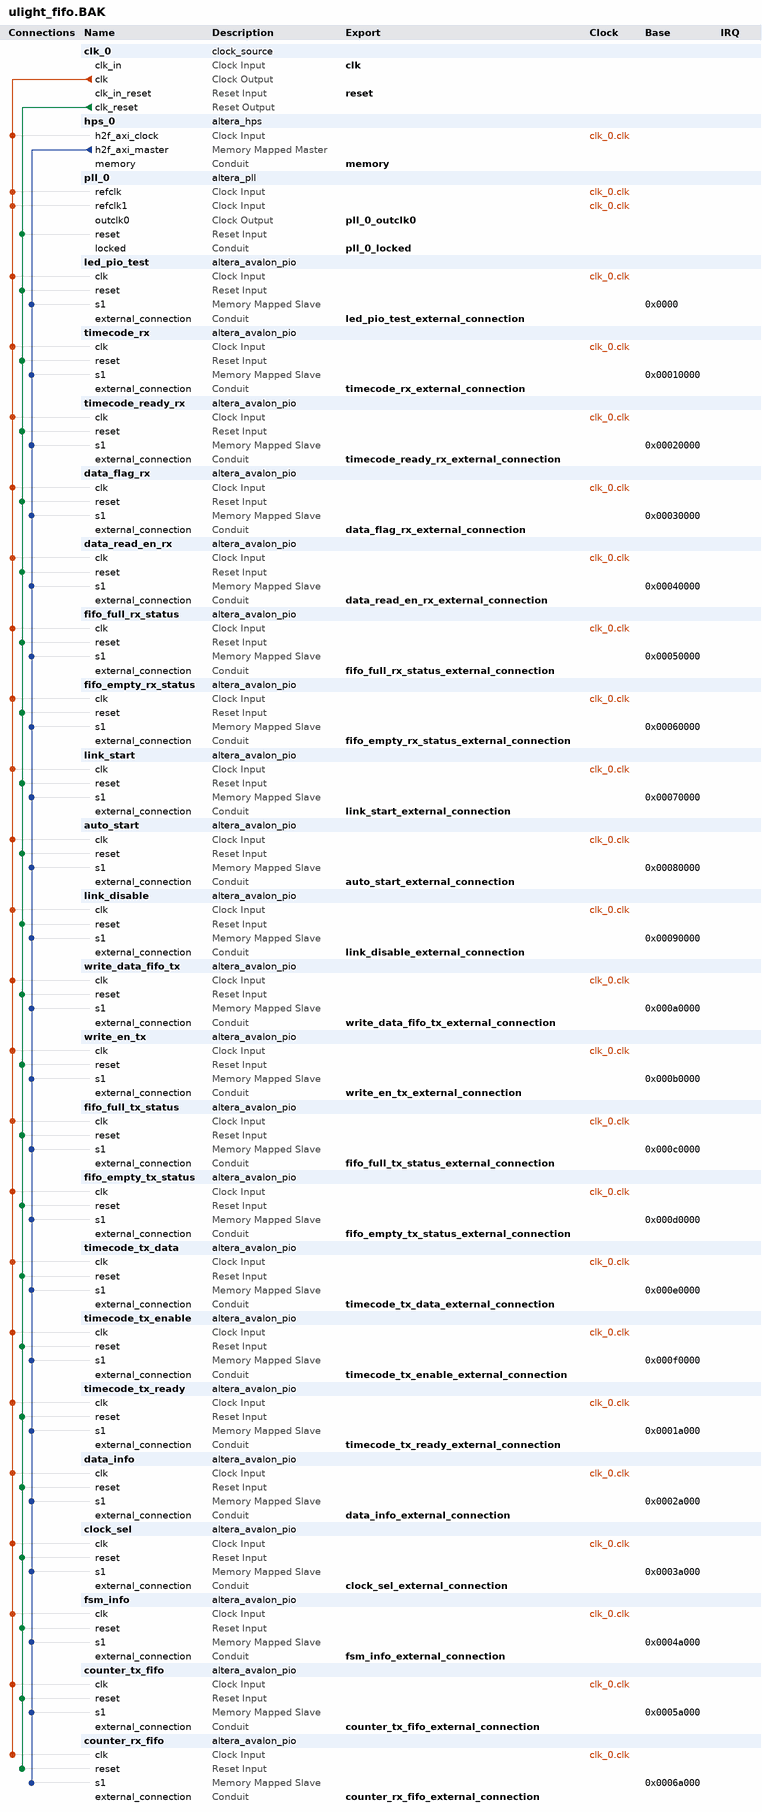
[diagram p0: system contents]
# Platform Designer (Qsys) system ulight_fifo.BAK, Cyclone V 5CSEMA4U23C6
# Parameters at their usual value, and those the tool derives, are not listed.
package require -exact qsys 17.0
create_system ulight_fifo.BAK
set_project_property DEVICE_FAMILY {Cyclone V}
set_project_property DEVICE 5CSEMA4U23C6

add_instance clk_0 clock_source 17.0
set_instance_parameter_value clk_0 clockFrequency 50000000

add_instance hps_0 altera_hps 17.0
set_instance_parameter_value hps_0 EMAC1_Mode N/A
set_instance_parameter_value hps_0 EMAC1_PinMuxing Unused
set_instance_parameter_value hps_0 F2SCLK_COLDRST_Enable false
set_instance_parameter_value hps_0 F2SCLK_DBGRST_Enable false
set_instance_parameter_value hps_0 F2SCLK_WARMRST_Enable false
set_instance_parameter_value hps_0 F2SINTERRUPT_Enable false
set_instance_parameter_value hps_0 F2S_Width 0
set_instance_parameter_value hps_0 FPGA_PERIPHERAL_OUTPUT_CLOCK_FREQ_EMAC0_GTX_CLK 125
set_instance_parameter_value hps_0 FPGA_PERIPHERAL_OUTPUT_CLOCK_FREQ_EMAC0_MD_CLK 2.5
set_instance_parameter_value hps_0 FPGA_PERIPHERAL_OUTPUT_CLOCK_FREQ_EMAC1_GTX_CLK 125
set_instance_parameter_value hps_0 FPGA_PERIPHERAL_OUTPUT_CLOCK_FREQ_EMAC1_MD_CLK 2.5
set_instance_parameter_value hps_0 HPS_PROTOCOL DDR3
set_instance_parameter_value hps_0 I2C0_Mode N/A
set_instance_parameter_value hps_0 I2C0_PinMuxing Unused
set_instance_parameter_value hps_0 I2C1_Mode N/A
set_instance_parameter_value hps_0 I2C1_PinMuxing Unused
set_instance_parameter_value hps_0 LWH2F_Enable false
set_instance_parameter_value hps_0 MEM_BANKADDR_WIDTH 3
set_instance_parameter_value hps_0 MEM_CLK_FREQ 300.0
set_instance_parameter_value hps_0 MEM_CLK_FREQ_MAX 400.0
set_instance_parameter_value hps_0 MEM_COL_ADDR_WIDTH 8
set_instance_parameter_value hps_0 MEM_DQ_WIDTH 8
set_instance_parameter_value hps_0 MEM_DRV_STR RZQ/6
set_instance_parameter_value hps_0 MEM_ROW_ADDR_WIDTH 12
set_instance_parameter_value hps_0 MEM_RTT_NOM {ODT Disabled}
set_instance_parameter_value hps_0 MEM_RTT_WR {Dynamic ODT off}
set_instance_parameter_value hps_0 MEM_TCL 7
set_instance_parameter_value hps_0 MEM_TFAW_NS 37.5
set_instance_parameter_value hps_0 MEM_TINIT_US 499
set_instance_parameter_value hps_0 MEM_TMRD_CK 3
set_instance_parameter_value hps_0 MEM_TRAS_NS 40.0
set_instance_parameter_value hps_0 MEM_TRCD_NS 15.0
set_instance_parameter_value hps_0 MEM_TREFI_US 7.0
set_instance_parameter_value hps_0 MEM_TRFC_NS 75.0
set_instance_parameter_value hps_0 MEM_TRP_NS 15.0
set_instance_parameter_value hps_0 MEM_TWTR 2
set_instance_parameter_value hps_0 MEM_VENDOR JEDEC
set_instance_parameter_value hps_0 MEM_WTCL 6
set_instance_parameter_value hps_0 QSPI_Mode N/A
set_instance_parameter_value hps_0 QSPI_PinMuxing Unused
set_instance_parameter_value hps_0 REF_CLK_FREQ 125.0
set_instance_parameter_value hps_0 S2FCLK_USER2CLK 5
set_instance_parameter_value hps_0 S2F_Width 1
set_instance_parameter_value hps_0 SDIO_Mode N/A
set_instance_parameter_value hps_0 SDIO_PinMuxing Unused
set_instance_parameter_value hps_0 SPIM1_Mode N/A
set_instance_parameter_value hps_0 SPIM1_PinMuxing Unused
set_instance_parameter_value hps_0 STM_Enable false
set_instance_parameter_value hps_0 TIMING_BOARD_AC_SKEW 0.02
set_instance_parameter_value hps_0 TIMING_BOARD_AC_TO_CK_SKEW 0.0
set_instance_parameter_value hps_0 TIMING_BOARD_DQ_TO_DQS_SKEW 0.0
set_instance_parameter_value hps_0 TIMING_BOARD_MAX_CK_DELAY 0.6
set_instance_parameter_value hps_0 TIMING_BOARD_MAX_DQS_DELAY 0.6
set_instance_parameter_value hps_0 TIMING_BOARD_SKEW_BETWEEN_DQS 0.02
set_instance_parameter_value hps_0 TIMING_BOARD_SKEW_CKDQS_DIMM_MAX 0.01
set_instance_parameter_value hps_0 TIMING_BOARD_SKEW_CKDQS_DIMM_MIN -0.01
set_instance_parameter_value hps_0 TIMING_BOARD_SKEW_WITHIN_DQS 0.02
set_instance_parameter_value hps_0 TIMING_TDH 125
set_instance_parameter_value hps_0 TIMING_TDQSCK 400
set_instance_parameter_value hps_0 TIMING_TDQSQ 120
set_instance_parameter_value hps_0 TIMING_TDS 50
set_instance_parameter_value hps_0 TIMING_TIH 250
set_instance_parameter_value hps_0 TIMING_TIS 175
set_instance_parameter_value hps_0 TIMING_TQSH 0.38
set_instance_parameter_value hps_0 UART0_Mode N/A
set_instance_parameter_value hps_0 UART0_PinMuxing Unused
set_instance_parameter_value hps_0 USB1_Mode N/A
set_instance_parameter_value hps_0 USB1_PinMuxing Unused
set_instance_parameter_value hps_0 desired_cfg_clk_mhz 100.0
set_instance_parameter_value hps_0 desired_qspi_clk_mhz 400.0
set_instance_parameter_value hps_0 eosc1_clk_mhz 50.0
set_instance_parameter_value hps_0 eosc2_clk_mhz 50.0

add_instance pll_0 altera_pll 17.0
set_instance_parameter_value pll_0 gui_device_speed_grade 1
set_instance_parameter_value pll_0 gui_number_of_clocks 1
set_instance_parameter_value pll_0 gui_operation_mode normal
set_instance_parameter_value pll_0 gui_output_clock_frequency0 400.0
set_instance_parameter_value pll_0 gui_pll_mode {Integer-N PLL}
set_instance_parameter_value pll_0 gui_refclk_switch true
set_instance_parameter_value pll_0 gui_reference_clock_frequency 50.0
set_instance_parameter_value pll_0 gui_use_locked true

add_instance led_pio_test altera_avalon_pio 17.0
set_instance_parameter_value led_pio_test direction Output
set_instance_parameter_value led_pio_test width 5

add_instance timecode_rx altera_avalon_pio 17.0
set_instance_parameter_value timecode_rx direction Input
set_instance_parameter_value timecode_rx width 8

add_instance timecode_ready_rx altera_avalon_pio 17.0
set_instance_parameter_value timecode_ready_rx direction Input
set_instance_parameter_value timecode_ready_rx width 1

add_instance data_flag_rx altera_avalon_pio 17.0
set_instance_parameter_value data_flag_rx direction Input
set_instance_parameter_value data_flag_rx width 9

add_instance data_read_en_rx altera_avalon_pio 17.0
set_instance_parameter_value data_read_en_rx direction Output
set_instance_parameter_value data_read_en_rx width 1

add_instance fifo_full_rx_status altera_avalon_pio 17.0
set_instance_parameter_value fifo_full_rx_status direction Input
set_instance_parameter_value fifo_full_rx_status width 1

add_instance fifo_empty_rx_status altera_avalon_pio 17.0
set_instance_parameter_value fifo_empty_rx_status direction Input
set_instance_parameter_value fifo_empty_rx_status width 1

add_instance link_start altera_avalon_pio 17.0
set_instance_parameter_value link_start direction Output
set_instance_parameter_value link_start width 1

add_instance auto_start altera_avalon_pio 17.0
set_instance_parameter_value auto_start direction Output
set_instance_parameter_value auto_start width 1

add_instance link_disable altera_avalon_pio 17.0
set_instance_parameter_value link_disable direction Output
set_instance_parameter_value link_disable width 1

add_instance write_data_fifo_tx altera_avalon_pio 17.0
set_instance_parameter_value write_data_fifo_tx direction Output
set_instance_parameter_value write_data_fifo_tx width 9

add_instance write_en_tx altera_avalon_pio 17.0
set_instance_parameter_value write_en_tx direction Output
set_instance_parameter_value write_en_tx width 1

add_instance fifo_full_tx_status altera_avalon_pio 17.0
set_instance_parameter_value fifo_full_tx_status direction Input
set_instance_parameter_value fifo_full_tx_status width 1

add_instance fifo_empty_tx_status altera_avalon_pio 17.0
set_instance_parameter_value fifo_empty_tx_status direction Input
set_instance_parameter_value fifo_empty_tx_status width 1

add_instance timecode_tx_data altera_avalon_pio 17.0
set_instance_parameter_value timecode_tx_data direction Output
set_instance_parameter_value timecode_tx_data width 8

add_instance timecode_tx_enable altera_avalon_pio 17.0
set_instance_parameter_value timecode_tx_enable direction Output
set_instance_parameter_value timecode_tx_enable width 1

add_instance timecode_tx_ready altera_avalon_pio 17.0
set_instance_parameter_value timecode_tx_ready direction Input
set_instance_parameter_value timecode_tx_ready width 1

add_instance data_info altera_avalon_pio 17.0
set_instance_parameter_value data_info direction Input
set_instance_parameter_value data_info width 14

add_instance clock_sel altera_avalon_pio 17.0
set_instance_parameter_value clock_sel direction Output
set_instance_parameter_value clock_sel width 3

add_instance fsm_info altera_avalon_pio 17.0
set_instance_parameter_value fsm_info direction Input
set_instance_parameter_value fsm_info width 6

add_instance counter_tx_fifo altera_avalon_pio 17.0
set_instance_parameter_value counter_tx_fifo direction Input
set_instance_parameter_value counter_tx_fifo width 6

add_instance counter_rx_fifo altera_avalon_pio 17.0
set_instance_parameter_value counter_rx_fifo direction Input
set_instance_parameter_value counter_rx_fifo width 6

# connections
add_connection clk_0.clk auto_start.clk clock
add_connection clk_0.clk clock_sel.clk clock
add_connection clk_0.clk counter_rx_fifo.clk clock
add_connection clk_0.clk counter_tx_fifo.clk clock
add_connection clk_0.clk data_flag_rx.clk clock
add_connection clk_0.clk data_info.clk clock
add_connection clk_0.clk data_read_en_rx.clk clock
add_connection clk_0.clk fifo_empty_rx_status.clk clock
add_connection clk_0.clk fifo_empty_tx_status.clk clock
add_connection clk_0.clk fifo_full_rx_status.clk clock
add_connection clk_0.clk fifo_full_tx_status.clk clock
add_connection clk_0.clk fsm_info.clk clock
add_connection clk_0.clk hps_0.h2f_axi_clock clock
add_connection clk_0.clk led_pio_test.clk clock
add_connection clk_0.clk link_disable.clk clock
add_connection clk_0.clk link_start.clk clock
add_connection clk_0.clk pll_0.refclk clock
add_connection clk_0.clk pll_0.refclk1 clock
add_connection clk_0.clk timecode_ready_rx.clk clock
add_connection clk_0.clk timecode_rx.clk clock
add_connection clk_0.clk timecode_tx_data.clk clock
add_connection clk_0.clk timecode_tx_enable.clk clock
add_connection clk_0.clk timecode_tx_ready.clk clock
add_connection clk_0.clk write_data_fifo_tx.clk clock
add_connection clk_0.clk write_en_tx.clk clock
add_connection clk_0.clk_reset auto_start.reset reset
add_connection clk_0.clk_reset clock_sel.reset reset
add_connection clk_0.clk_reset counter_rx_fifo.reset reset
add_connection clk_0.clk_reset counter_tx_fifo.reset reset
add_connection clk_0.clk_reset data_flag_rx.reset reset
add_connection clk_0.clk_reset data_info.reset reset
add_connection clk_0.clk_reset data_read_en_rx.reset reset
add_connection clk_0.clk_reset fifo_empty_rx_status.reset reset
add_connection clk_0.clk_reset fifo_empty_tx_status.reset reset
add_connection clk_0.clk_reset fifo_full_rx_status.reset reset
add_connection clk_0.clk_reset fifo_full_tx_status.reset reset
add_connection clk_0.clk_reset fsm_info.reset reset
add_connection clk_0.clk_reset led_pio_test.reset reset
add_connection clk_0.clk_reset link_disable.reset reset
add_connection clk_0.clk_reset link_start.reset reset
add_connection clk_0.clk_reset pll_0.reset reset
add_connection clk_0.clk_reset timecode_ready_rx.reset reset
add_connection clk_0.clk_reset timecode_rx.reset reset
add_connection clk_0.clk_reset timecode_tx_data.reset reset
add_connection clk_0.clk_reset timecode_tx_enable.reset reset
add_connection clk_0.clk_reset timecode_tx_ready.reset reset
add_connection clk_0.clk_reset write_data_fifo_tx.reset reset
add_connection clk_0.clk_reset write_en_tx.reset reset
add_connection hps_0.h2f_axi_master auto_start.s1 avalon
set_connection_parameter_value hps_0.h2f_axi_master/auto_start.s1 baseAddress 0x00080000
add_connection hps_0.h2f_axi_master clock_sel.s1 avalon
set_connection_parameter_value hps_0.h2f_axi_master/clock_sel.s1 baseAddress 0x0003a000
add_connection hps_0.h2f_axi_master counter_rx_fifo.s1 avalon
set_connection_parameter_value hps_0.h2f_axi_master/counter_rx_fifo.s1 baseAddress 0x0006a000
add_connection hps_0.h2f_axi_master counter_tx_fifo.s1 avalon
set_connection_parameter_value hps_0.h2f_axi_master/counter_tx_fifo.s1 baseAddress 0x0005a000
add_connection hps_0.h2f_axi_master data_flag_rx.s1 avalon
set_connection_parameter_value hps_0.h2f_axi_master/data_flag_rx.s1 baseAddress 0x00030000
add_connection hps_0.h2f_axi_master data_info.s1 avalon
set_connection_parameter_value hps_0.h2f_axi_master/data_info.s1 baseAddress 0x0002a000
add_connection hps_0.h2f_axi_master data_read_en_rx.s1 avalon
set_connection_parameter_value hps_0.h2f_axi_master/data_read_en_rx.s1 baseAddress 0x00040000
add_connection hps_0.h2f_axi_master fifo_empty_rx_status.s1 avalon
set_connection_parameter_value hps_0.h2f_axi_master/fifo_empty_rx_status.s1 baseAddress 0x00060000
add_connection hps_0.h2f_axi_master fifo_empty_tx_status.s1 avalon
set_connection_parameter_value hps_0.h2f_axi_master/fifo_empty_tx_status.s1 baseAddress 0x000d0000
add_connection hps_0.h2f_axi_master fifo_full_rx_status.s1 avalon
set_connection_parameter_value hps_0.h2f_axi_master/fifo_full_rx_status.s1 baseAddress 0x00050000
add_connection hps_0.h2f_axi_master fifo_full_tx_status.s1 avalon
set_connection_parameter_value hps_0.h2f_axi_master/fifo_full_tx_status.s1 baseAddress 0x000c0000
add_connection hps_0.h2f_axi_master fsm_info.s1 avalon
set_connection_parameter_value hps_0.h2f_axi_master/fsm_info.s1 baseAddress 0x0004a000
add_connection hps_0.h2f_axi_master led_pio_test.s1 avalon
set_connection_parameter_value hps_0.h2f_axi_master/led_pio_test.s1 baseAddress 0x0000
add_connection hps_0.h2f_axi_master link_disable.s1 avalon
set_connection_parameter_value hps_0.h2f_axi_master/link_disable.s1 baseAddress 0x00090000
add_connection hps_0.h2f_axi_master link_start.s1 avalon
set_connection_parameter_value hps_0.h2f_axi_master/link_start.s1 baseAddress 0x00070000
add_connection hps_0.h2f_axi_master timecode_ready_rx.s1 avalon
set_connection_parameter_value hps_0.h2f_axi_master/timecode_ready_rx.s1 baseAddress 0x00020000
add_connection hps_0.h2f_axi_master timecode_rx.s1 avalon
set_connection_parameter_value hps_0.h2f_axi_master/timecode_rx.s1 baseAddress 0x00010000
add_connection hps_0.h2f_axi_master timecode_tx_data.s1 avalon
set_connection_parameter_value hps_0.h2f_axi_master/timecode_tx_data.s1 baseAddress 0x000e0000
add_connection hps_0.h2f_axi_master timecode_tx_enable.s1 avalon
set_connection_parameter_value hps_0.h2f_axi_master/timecode_tx_enable.s1 baseAddress 0x000f0000
add_connection hps_0.h2f_axi_master timecode_tx_ready.s1 avalon
set_connection_parameter_value hps_0.h2f_axi_master/timecode_tx_ready.s1 baseAddress 0x0001a000
add_connection hps_0.h2f_axi_master write_data_fifo_tx.s1 avalon
set_connection_parameter_value hps_0.h2f_axi_master/write_data_fifo_tx.s1 baseAddress 0x000a0000
add_connection hps_0.h2f_axi_master write_en_tx.s1 avalon
set_connection_parameter_value hps_0.h2f_axi_master/write_en_tx.s1 baseAddress 0x000b0000

# exported interfaces
add_interface auto_start_external_connection conduit end
set_interface_property auto_start_external_connection EXPORT_OF auto_start.external_connection
add_interface clk clock sink
set_interface_property clk EXPORT_OF clk_0.clk_in
add_interface clock_sel_external_connection conduit end
set_interface_property clock_sel_external_connection EXPORT_OF clock_sel.external_connection
add_interface counter_rx_fifo_external_connection conduit end
set_interface_property counter_rx_fifo_external_connection EXPORT_OF counter_rx_fifo.external_connection
add_interface counter_tx_fifo_external_connection conduit end
set_interface_property counter_tx_fifo_external_connection EXPORT_OF counter_tx_fifo.external_connection
add_interface data_flag_rx_external_connection conduit end
set_interface_property data_flag_rx_external_connection EXPORT_OF data_flag_rx.external_connection
add_interface data_info_external_connection conduit end
set_interface_property data_info_external_connection EXPORT_OF data_info.external_connection
add_interface data_read_en_rx_external_connection conduit end
set_interface_property data_read_en_rx_external_connection EXPORT_OF data_read_en_rx.external_connection
add_interface fifo_empty_rx_status_external_connection conduit end
set_interface_property fifo_empty_rx_status_external_connection EXPORT_OF fifo_empty_rx_status.external_connection
add_interface fifo_empty_tx_status_external_connection conduit end
set_interface_property fifo_empty_tx_status_external_connection EXPORT_OF fifo_empty_tx_status.external_connection
add_interface fifo_full_rx_status_external_connection conduit end
set_interface_property fifo_full_rx_status_external_connection EXPORT_OF fifo_full_rx_status.external_connection
add_interface fifo_full_tx_status_external_connection conduit end
set_interface_property fifo_full_tx_status_external_connection EXPORT_OF fifo_full_tx_status.external_connection
add_interface fsm_info_external_connection conduit end
set_interface_property fsm_info_external_connection EXPORT_OF fsm_info.external_connection
add_interface led_pio_test_external_connection conduit end
set_interface_property led_pio_test_external_connection EXPORT_OF led_pio_test.external_connection
add_interface link_disable_external_connection conduit end
set_interface_property link_disable_external_connection EXPORT_OF link_disable.external_connection
add_interface link_start_external_connection conduit end
set_interface_property link_start_external_connection EXPORT_OF link_start.external_connection
add_interface memory conduit end
set_interface_property memory EXPORT_OF hps_0.memory
add_interface pll_0_locked conduit end
set_interface_property pll_0_locked EXPORT_OF pll_0.locked
add_interface pll_0_outclk0 clock source
set_interface_property pll_0_outclk0 EXPORT_OF pll_0.outclk0
add_interface reset reset sink
set_interface_property reset EXPORT_OF clk_0.clk_in_reset
add_interface timecode_ready_rx_external_connection conduit end
set_interface_property timecode_ready_rx_external_connection EXPORT_OF timecode_ready_rx.external_connection
add_interface timecode_rx_external_connection conduit end
set_interface_property timecode_rx_external_connection EXPORT_OF timecode_rx.external_connection
add_interface timecode_tx_data_external_connection conduit end
set_interface_property timecode_tx_data_external_connection EXPORT_OF timecode_tx_data.external_connection
add_interface timecode_tx_enable_external_connection conduit end
set_interface_property timecode_tx_enable_external_connection EXPORT_OF timecode_tx_enable.external_connection
add_interface timecode_tx_ready_external_connection conduit end
set_interface_property timecode_tx_ready_external_connection EXPORT_OF timecode_tx_ready.external_connection
add_interface write_data_fifo_tx_external_connection conduit end
set_interface_property write_data_fifo_tx_external_connection EXPORT_OF write_data_fifo_tx.external_connection
add_interface write_en_tx_external_connection conduit end
set_interface_property write_en_tx_external_connection EXPORT_OF write_en_tx.external_connection

set_interconnect_requirement {$system} qsys_mm.clockCrossingAdapter HANDSHAKE
set_interconnect_requirement {$system} qsys_mm.enableEccProtection FALSE
set_interconnect_requirement {$system} qsys_mm.insertDefaultSlave FALSE
set_interconnect_requirement {$system} qsys_mm.maxAdditionalLatency 1

save_system ulight_fifo.BAK.qsys
